# EAGLE design infinity_mirror_revd (EAGLE 9.6.2)
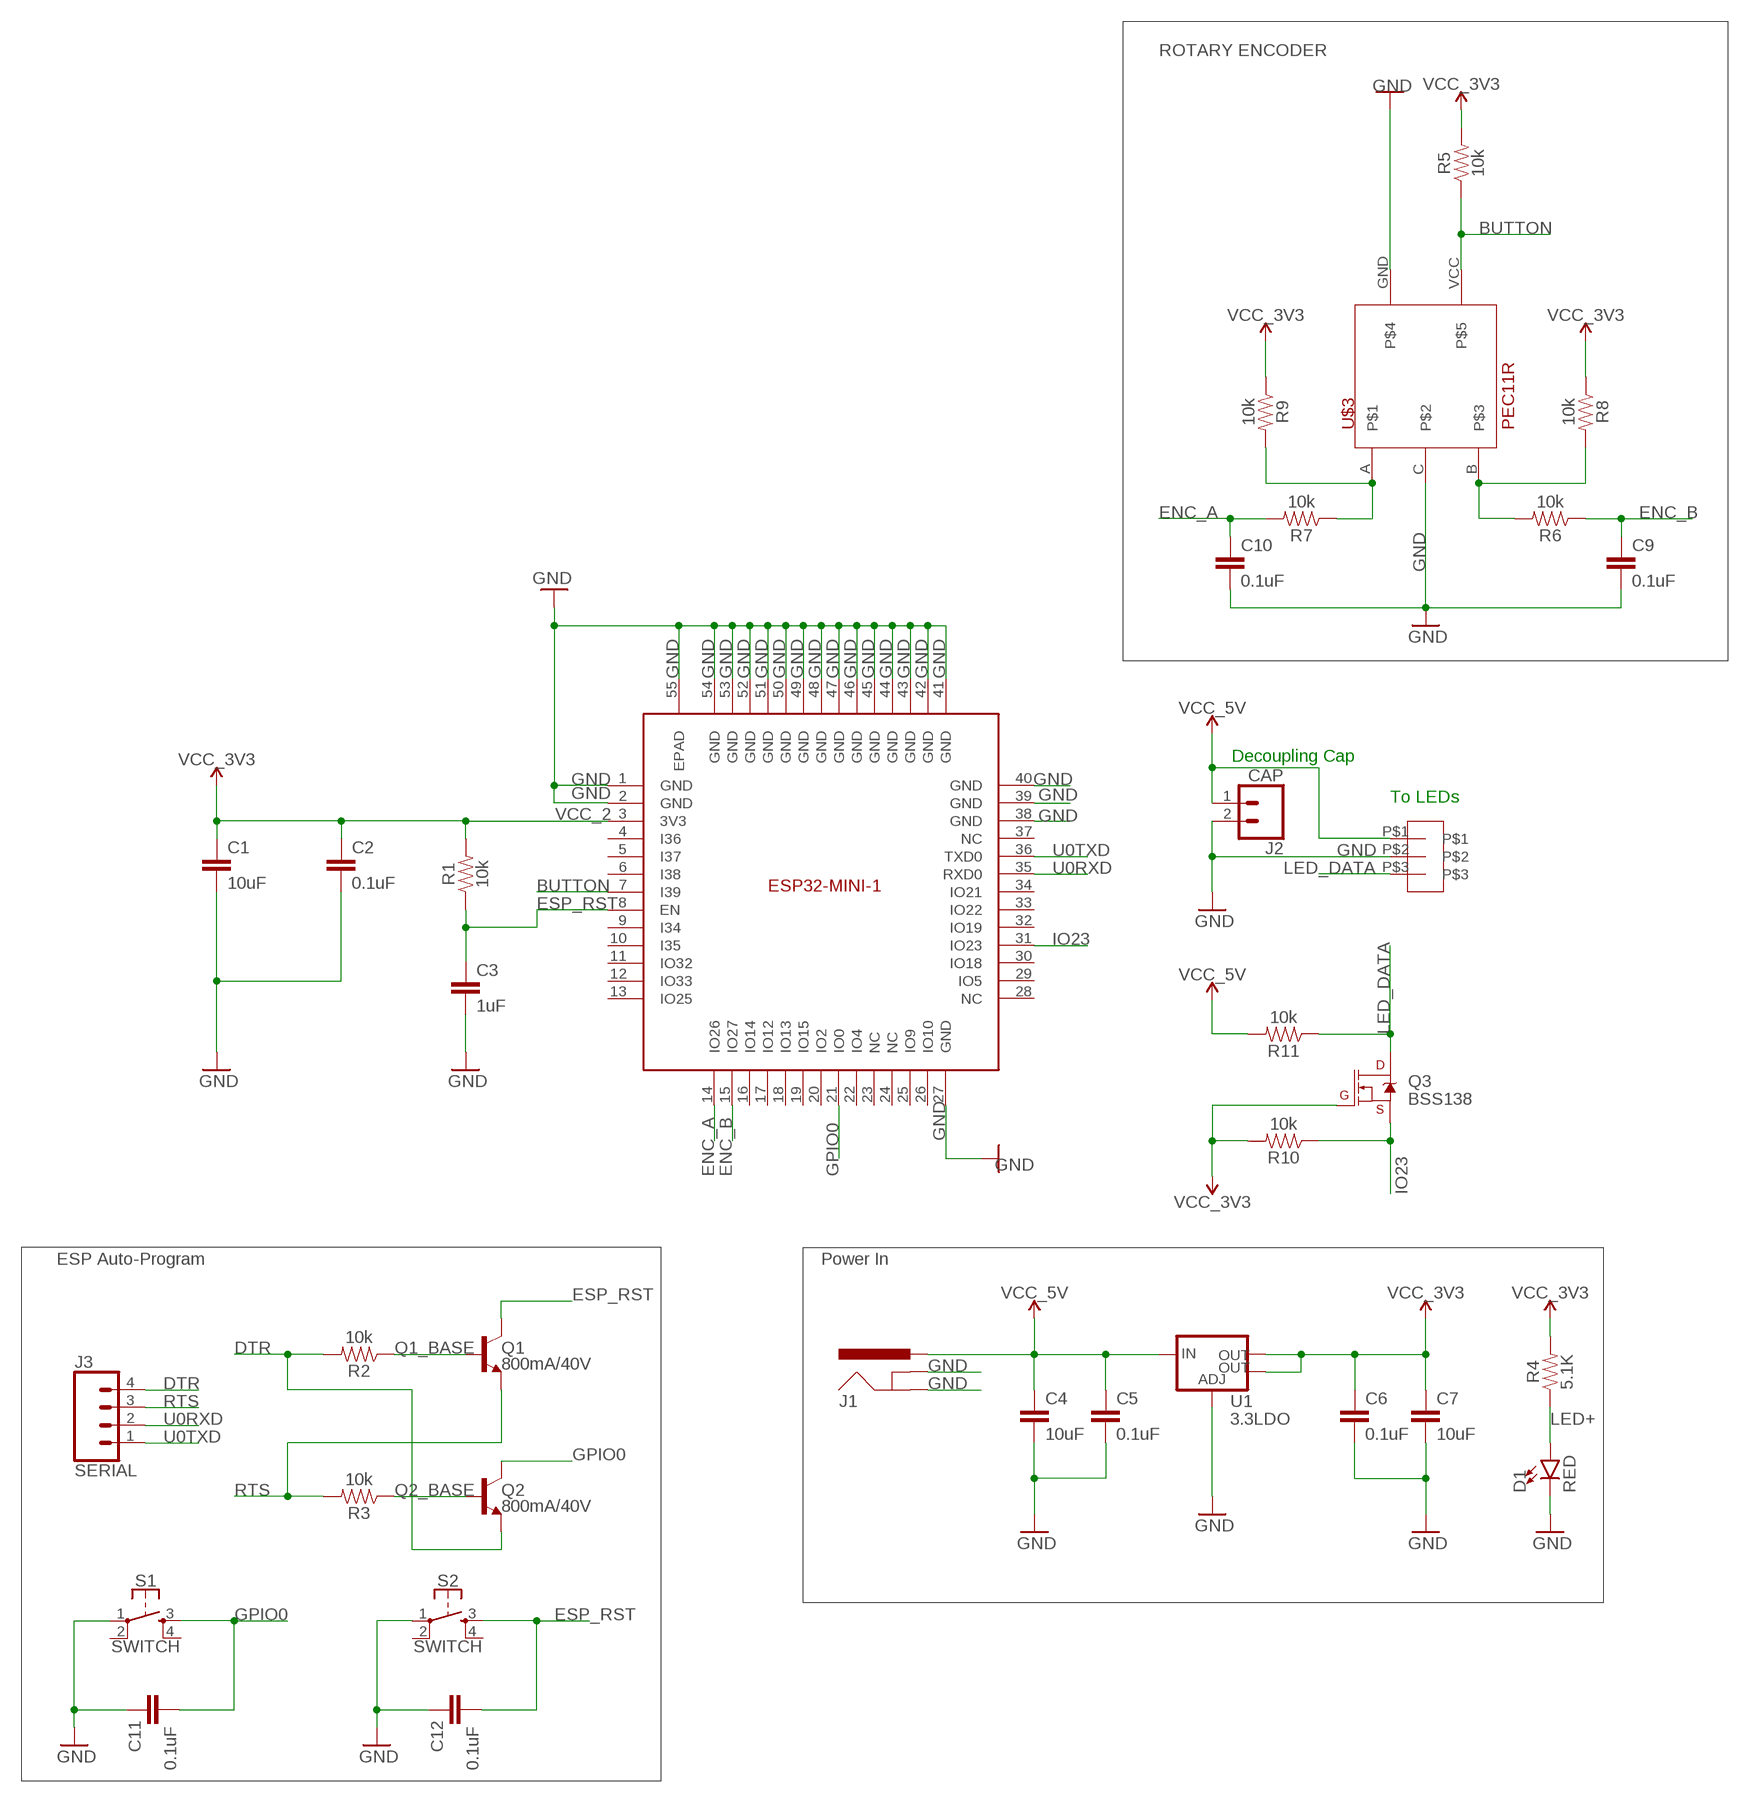
[diagram p0: schematic, sheet 1]

## Parts
C1  10uF  CAPACITOR  [0805]
C2  0.1uF  CAPACITOR  [0805]
C3  1uF  CAPACITOR  [0805]
C4  10uF  CAPACITOR  [0805]
C5  0.1uF  CAPACITOR  [0805]
C6  0.1uF  CAPACITOR  [0805]
C7  10uF  CAPACITOR  [0805]
C9  0.1uF  CAPACITOR  [0805]
C10  0.1uF  CAPACITOR  [0805]
C11  0.1uF  CAPACITOR  [0805]
C12  0.1uF  CAPACITOR  [0805]
D1  RED  LED-RED1206  [LED-1206]
J1  POWER_JACKPTH_BREAD  [POWER_JACK_PTH_BREAD]
J2  CAP  CONN_02  [1X02]
J3  SERIAL  CONN_04  [1X04]
Q1  800mA/40V  TRANS_NPN-MMBT2222AL  [SOT23-3]
Q2  800mA/40V  TRANS_NPN-MMBT2222AL  [SOT23-3]
Q3  BSS138  MOSFET-NCH-BSS138  [SOT23-3]
R1  10k  RESISTOR  [0805]
R2  10k  RESISTOR  [0805]
R3  10k  RESISTOR  [0805]
R4  5.1K  RESISTOR  [0805]
R5  10k  RESISTOR  [0805]
R6  10k  RESISTOR  [0805]
R7  10k  RESISTOR  [0805]
R8  10k  RESISTOR  [0805]
R9  10k  RESISTOR  [0805]
R10  10k  RESISTOR  [0805]
R11  10k  RESISTOR  [0805]
S1  SWITCH  MOMENTARY-SWITCH-SPST-2-SMD-5.2MM-TALL  [TACTILE_SWITCH_SMD_5.2MM]
S2  SWITCH  MOMENTARY-SWITCH-SPST-2-SMD-5.2MM-TALL  [TACTILE_SWITCH_SMD_5.2MM]
U1  3.3LDO  V_REG_LM1117SOT223  [SOT223]
U$1  ESP32-MINI-1-N4  [ESP32-MINI-1-N4]
U$2  3-PIN-JST  [3-PIN-JST]
U$3  PEC11R  PEC11R_ROTARY_ENCODER  [PEC11R-4320F-S0012]

## Nets
BUTTON: R5.1 U$1.7(I39) U$3.VCC
DTR: J3.4 Q2.2(E) R2.2
ENC_A: C10.1 R7.2 U$1.14(IO26)
ENC_B: C9.1 R6.1 U$1.15(IO27)
ESP_RST: C3.1 C12.2 Q1.3(C) R1.1 S2.3 U$1.8(EN)
GND: C1.2 C2.2 C3.2 C4.2 C5.2 C6.2 C7.2 C9.2 C10.2 C11.1 C12.1 D1.C J1.GND J1.GNDBREAK J2.2 S1.1 S2.1 U1.1(ADJ) U$1.1(GND) U$1.2(GND) U$1.27(GND) U$1.38(GND) U$1.39(GND) U$1.40(GND) U$1.41(GND) U$1.42(GND) U$1.43(GND) U$1.44(GND) U$1.45(GND) U$1.46(GND) U$1.47(GND) U$1.48(GND) U$1.49(GND) U$1.50(GND) U$1.51(GND) U$1.52(GND) U$1.53(GND) U$1.54(GND) U$1.55(EPAD) U$2.P$2 U$3.C U$3.GND
GPIO0: C11.2 Q2.3(C) S1.3 U$1.21(IO0)
IO23: Q3.2(S) R10.1 U$1.31(IO23)
LED+: D1.A R4.1
LED_DATA: Q3.3(D) R11.1 U$2.P$3
N$2: R6.2 R8.2 U$3.B
N$3: R7.1 R9.2 U$3.A
Q1_BASE: Q1.1(B) R2.1
Q2_BASE: Q2.1(B) R3.1
RTS: J3.3 Q1.2(E) R3.2
U0RXD: J3.2 U$1.35(RXD0)
U0TXD: J3.1 U$1.36(TXD0)
VCC_1: C4.1 C5.1 J1.PWR J2.1 R11.2 U1.3(IN) U$2.P$1 ; supply symbol labelled VCC_5V
VCC_2: C1.1 C2.1 C6.1 C7.1 Q3.1(G) R1.2 R4.2 R5.2 R8.1 R9.1 R10.2 U1.2(OUT) U1.4(OUT) U$1.3(3V3) ; supply symbol labelled VCC_3V3
Unconnected: S1.2 S1.4 S2.2 S2.4 U$1.4(I36) U$1.5(I37) U$1.6(I38) U$1.9(I34) U$1.10(I35) U$1.11(IO32) U$1.12(IO33) U$1.13(IO25) U$1.16(IO14) U$1.17(IO12) U$1.18(IO13) U$1.19(IO15) U$1.20(IO2) U$1.22(IO4) U$1.23(NC) U$1.24(NC) U$1.25(IO9) U$1.26(IO10) U$1.28(NC) U$1.29(IO5) U$1.30(IO18) U$1.32(IO19) U$1.33(IO22) U$1.34(IO21) U$1.37(NC)

## Notes on the sheet
- ROTARY ENCODER
- Decoupling Cap
- To LEDs
- ESP Auto-Program | Power In

## Library data of the parts
C1-C7 C9-C12 = _111_IH:CAPACITOR
D1 = SparkFun-LED:LED-RED: Red SMD LED Used in manufacturing of most products at SparkFun Packages: 0603 - SMD 0603 package [Product Link] <http://docs.avagotech.com/docs/AV02-0551EN> 0603 SMART - SMD 0603 SMART package ( more efficient and expensive)[Product Link] <http://www.osram-os.com/Graphics/XPic2/00077099_0.pdf> 1206 - SMD1206 package [Product Link] <https://www.sparkfun.com/datasheets/DevTools/LilyPad/Q150OVS4.pdff> SparkFun Products: Pro Mini 328 -5V <https://www.sparkfun.com/products/821> RedBoard <https://www.sparkfun.com/products/12757> IOIO-OTG <https://www.sparkfun.com/products/13613>; PROD_ID: DIO-09912
J1 = SparkFun-Connectors:POWER_JACK: Power Jack Connector This is the standard 5.5mm barrel jack for power. The PTH is the most common, proven, reliable, footprint. The Slot footprint only works if the mill layer is transmitted to the PCB fab house so be warned. Here are the connectors we sell at SparkFun: DC Barrel Power Jack/Connector <https://www.sparkfun.com/products/119> (PRT-00119) DC Barrel Power Jack/Connector (SMD) <https://www.sparkfun.com/products/12748> (PRT-12748) DC Barrel Jack Adapter - Breadboard Compatible <https://www.sparkfun.com/products/10811> (PRT-10811) It is used on this SparkFun product (and many, many others): SparkFun RedBoard - Programmed with Arduino <https://www.sparkfun.com/products/12757> (DEV-12757) Also, if you need a mating power supply or connector, please check these out: Wall Adapter Power Supply - 9VDC 650mA <https://www.sparkfun.com/products/298> (TOL-00298) DC Barrel Jack Adapter - Male <https://www.sparkfun.com/products/10287> (PRT-10287); PROD_ID: PRT-10811
J2 = SparkFun-Connectors:CONN_02: Multi connection point. Often used as Generic Header-pin footprint for 0.1 inch spaced/style header connections On any of the 0.1 inch spaced packages, you can populate with these: Break Away Headers - Straight <https://www.sparkfun.com/products/116> (PRT-00116) Break Away Male Headers - Right Angle <https://www.sparkfun.com/products/553> (PRT-00553) Female Headers <https://www.sparkfun.com/products/115> (PRT-00115) Break Away Headers - Machine Pin <https://www.sparkfun.com/products/117> (PRT-00117) Break Away Female Headers - Swiss Machine Pin <https://www.sparkfun.com/products/743> (PRT-00743) For SCREWTERMINALS and SPRING TERMINALS visit here: Screw Terimnals on SparkFun.com <https://www.sparkfun.com/search/results?term=Screw+Terminals> (5mm/3.5mm/2.54mm spacing) This device is also useful as a general connection point to wire up your design to another part of your project. Our various solder wires solder well into these plated through hole pads. Hook-Up Wire - Assortment (Stranded, 22 AWG) <https://www.sparkfun.com/products/11375> (PRT-11375) Hook-Up Wire - Assortment (Solid Core, 22 AWG) <https://www.sparkfun.com/products/11367> (PRT-11367) View the entire wire category on our website here <https://www.sparkfun.com/categories/141> Special notes: Molex polarized connector foot print use with: PRT-08233 with associated crimp pins and housings. 2.54_SCREWTERM for use with PRT-10571. 3.5mm Screw Terminal footprints for PRT-08084 5mm Screw Terminal footprints for use with PRT-08432
J3 = SparkFun-Connectors:CONN_04: Multi connection point. Often used as Generic Header-pin footprint for 0.1 inch spaced/style header connections On any of the 0.1 inch spaced packages, you can populate with these: Break Away Headers - Straight <https://www.sparkfun.com/products/116> (PRT-00116) Break Away Male Headers - Right Angle <https://www.sparkfun.com/products/553> (PRT-00553) Female Headers <https://www.sparkfun.com/products/115> (PRT-00115) Break Away Headers - Machine Pin <https://www.sparkfun.com/products/117> (PRT-00117) Break Away Female Headers - Swiss Machine Pin <https://www.sparkfun.com/products/743> (PRT-00743) For SCREWTERMINALS and SPRING TERMINALS visit here: Screw Terimnals on SparkFun.com <https://www.sparkfun.com/search/results?term=Screw+Terminals> (5mm/3.5mm/2.54mm spacing) This device is also useful as a general connection point to wire up your design to another part of your project. Our various solder wires solder well into these plated through hole pads. Hook-Up Wire - Assortment (Stranded, 22 AWG) <https://www.sparkfun.com/products/11375> (PRT-11375) Hook-Up Wire - Assortment (Solid Core, 22 AWG) <https://www.sparkfun.com/products/11367> (PRT-11367) View the entire wire category on our website here <https://www.sparkfun.com/categories/141> Special notes: Molex polarized connector foot print use with SKU : PRT-08231 with associated crimp pins and housings. 1MM SMD Version SKU: PRT-10208; PROD_ID: CONN-09696
Q1 Q2 = SparkFun-DiscreteSemi:TRANS_NPN: NPN transistor Current controlled devices typically used to amplify current or used as a switch. BC547 - COM-08928 <http://www.sparkfun.com/products/8928> (TO-92 45V 100mA) (1.Collector 2.Base 3.Emitter) 2N3904 - COM-00521 <http://www.sparkfun.com/products/521> (TO-92 40V 200mA) (1.Emitter 2.Base 3.Collector) P2N2222A - COM-12852 <http://www.sparkfun.com/products/12852> (TO-92 40V 600mA) (1.Collector 2.Base 3.Emitter); PROD_ID: TRANS-08049; VALUE: 600mA/40V
Q3 = SparkFun-DiscreteSemi:MOSFET-NCH: N-channel MOSFETs Voltage controlled devices that allow control of high current outputs. SparkFun Products: SparkFun OpenScale <https://www.sparkfun.com/products/13261> SparkFun Digital Sandbox <https://www.sparkfun.com/products/12651> SparkFun Monster Moto Shield <https://www.sparkfun.com/products/10182> SparkFun MOSFET Power Controller <https://www.sparkfun.com/products/11214>; PROD_ID: TRANS-00830; VALUE: 220mA/50V/3.5Ω
R1-R11 = _111_IH:RESISTOR
S1 S2 = SparkFun-Switches:MOMENTARY-SWITCH-SPST-2: Momentary Switch (Pushbutton) - SPST - Two Circuits Normally-open (NO) SPST momentary switches (buttons, pushbuttons). Schematic symbol includes two switch circuits. Variants SMD-4.6MMX2.8MM - 4.60mm x 2.80mm Tactile Momentary Button Switch - Used on SparkFun Pro Micro - RP2040 <https://www.sparkfun.com/products/17717> SMD-5.2MM - Mini Pushbutton Switch - SMD <https://www.sparkfun.com/products/8720> - Used on Arduino Pro Mini <https://www.sparkfun.com/products/11114>; PROD_ID: SWCH-14139
U1 = SparkFun-IC-Power:V_REG_LM1117: Voltage Regulator LM1117 Standard adjustable voltage regulator but in SMD form. Spark Fun Electronics SKU : COM-00595; PROD_ID: VREG-08170
U$1 = infinity_mirror_revd:ESP32-MINI-1-N4: ESP32-MINI-N4
U$2 = infinity_mirror_revd:3-PIN-JST
U$3 = infinity_mirror_revd:PEC11R_ROTARY_ENCODER: 4 = PC Pin Horizontal / Rear Facing 3 = 12 Detents 20 = 20.0mm long shaft F = Metal Flatted Shaft S = Push Momentary Switch 001 = 12 pulses per 360

## Board
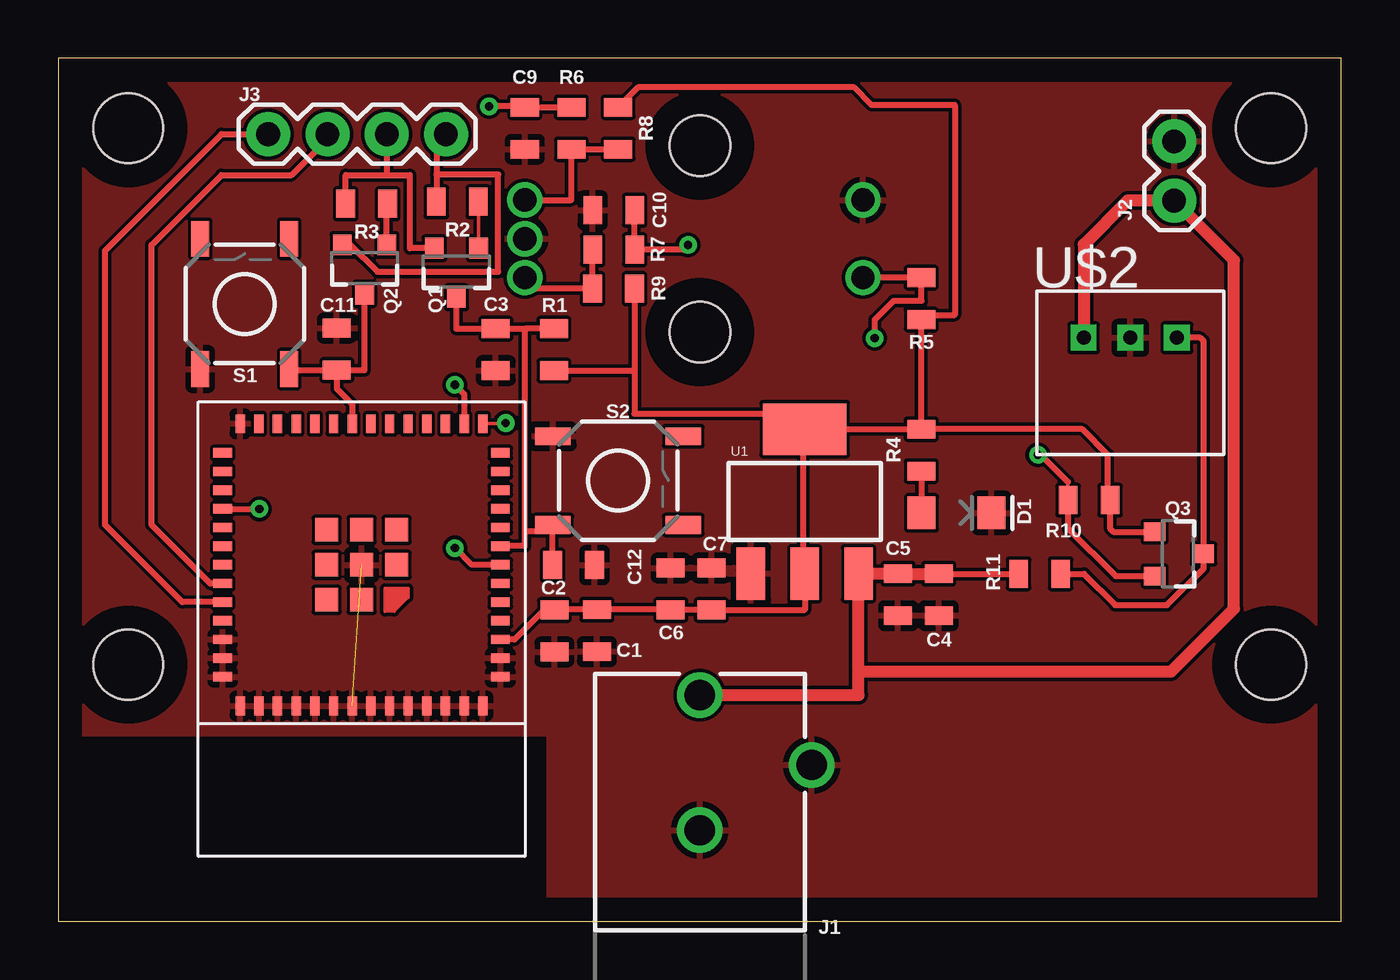
[diagram p1: board, top side]
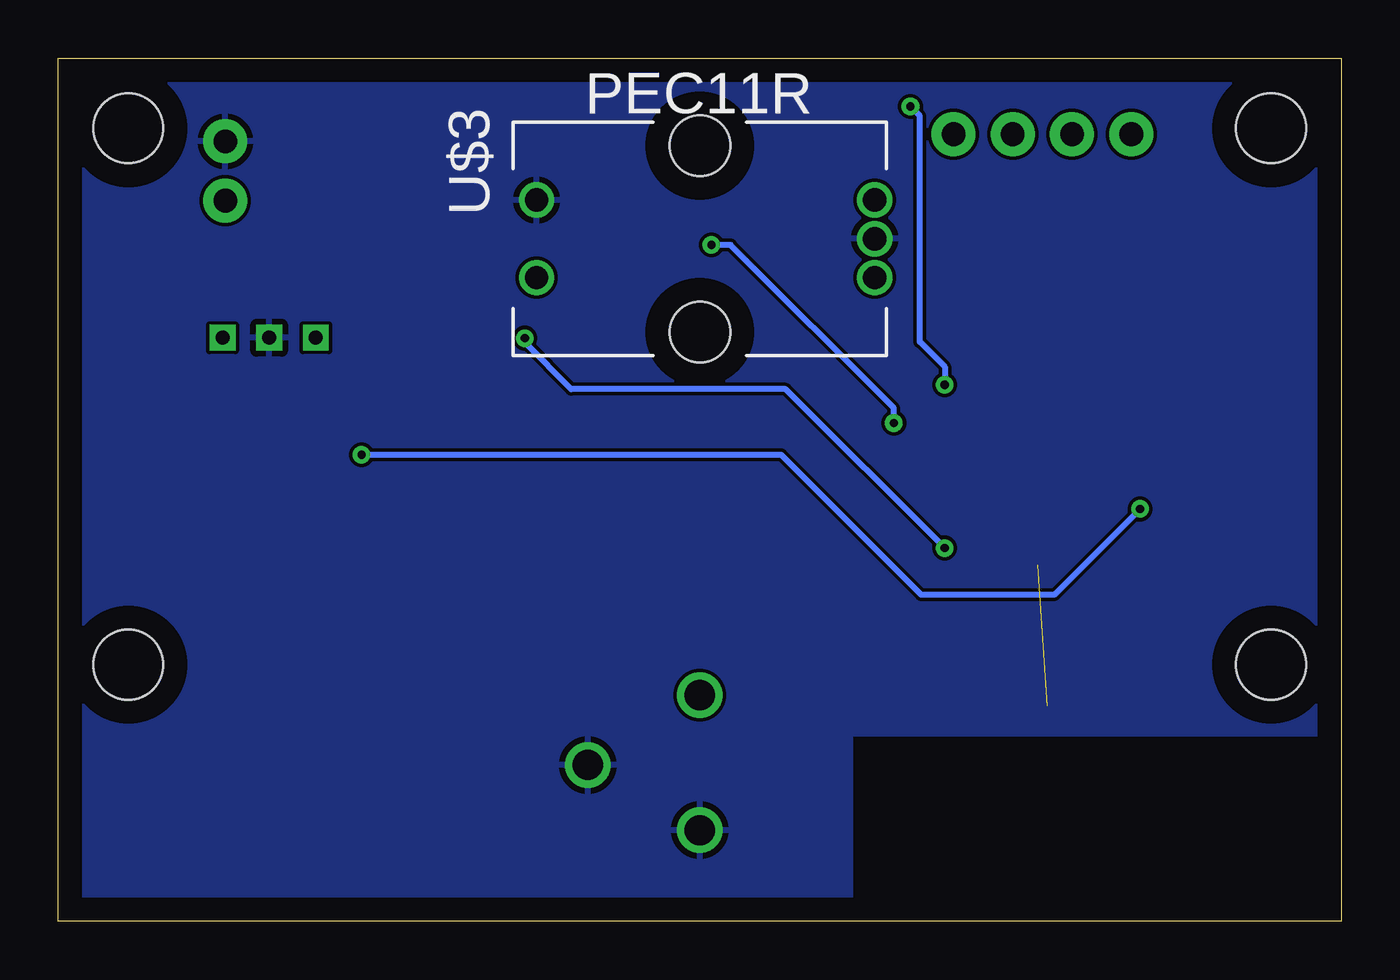
[diagram p2: board, bottom side, seen from below]

Size 55 x 37 mm. Coordinates in mm from the lower left corner, seen from the top.
Outline: 0,0 55,0 55,37 0,37 0,0
Copper layers (1*16): Top 0.035mm / dielectric 1.5mm / Bottom 0.035mm
Design rules "default": minimum track width 6mil, minimum drill 0.35mm, track to track 6mil, track to pad 6mil, pad to pad 6mil, via to via 6mil, smd to smd 6mil, copper to edge 40mil, drill to drill 6mil, minimum pad ring 10mil, minimum via ring 8mil, stop-mask expansion 4mil, vias tented up to drill 0mil, thermal gap 10mil
Holes 3 mm at 3,34 52,34 52,11 3,11
tKeepout: area 0.5,31.5 to 5.5,36.5; area 0.5,8.5 to 5.5,13.5; area 49.5,8.5 to 54.5,13.5; area 49.5,31.5 to 54.5,36.5

### Footprints (pad centres in the part's own frame; a part is rotated, then mirrored left to right if it is on the bottom)
0805 = smd 0.8 x 1.2: 1 -0.9,0; 2 0.9,0
LED-1206 = smd 1.2 x 1.4: A -1.5,0; C 1.5,0
POWER_JACK_PTH_BREAD = drill 1.3: GND 0,7.9; GNDBREAK 4.8,10.7; PWR 0,13.7
1X02 = drill 1.016 pad 1.88: 1 0,0; 2 2.54,0
1X04 = drill 1.016 pad 1.88: 1 0,0; 2 2.54,0; 3 5.08,0; 4 7.62,0
SOT23-3 = smd 0.8 x 0.9: 1 -0.95,-1; 2 0.95,-1; 3 0,1.1
TACTILE_SWITCH_SMD_5.2MM = smd 1.524 x 0.762: 1 -2.794,1.905; 2 2.794,1.905; 3 -2.794,-1.905; 4 2.794,-1.905
SOT223 = smd 1.219 x 2.235: 1 -2.311,-3.099; 2 0,-3.099; 3 2.311,-3.099 | smd 3.6 x 2.2: 4 0,3.099
ESP32-MINI-1-N4 = smd 0.8 x 0.4: 1 -5.95,4.8; 2 -5.95,4; 3 -5.95,3.2; 4 -5.95,2.4; 5 -5.95,1.6; 6 -5.95,0.8; 7 -5.95,0; 8 -5.95,-0.8; 9 -5.95,-1.6; 10 -5.95,-2.4; 11 -5.95,-3.2; 12 -5.95,-4; 13 -5.95,-4.8; 28 5.95,-4.8; 29 5.95,-4; 30 5.95,-3.2; 31 5.95,-2.4; 32 5.95,-1.6; 33 5.95,-0.8; 34 5.95,0; 35 5.95,0.8; 36 5.95,1.6; 37 5.95,2.4; 38 5.95,3.2; 39 5.95,4; 40 5.95,4.8 | smd 0.4 x 0.8: 14 -5.2,-6.05; 15 -4.4,-6.05; 16 -3.6,-6.05; 17 -2.8,-6.05; 18 -2,-6.05; 19 -1.2,-6.05; 20 -0.4,-6.05; 21 0.4,-6.05; 22 1.2,-6.05; 23 2,-6.05; 24 2.8,-6.05; 25 3.6,-6.05; 26 4.4,-6.05; 27 5.2,-6.05; 41 5.2,6.05; 42 4.4,6.05; 43 3.6,6.05; 44 2.8,6.05; 45 2,6.05; 46 1.2,6.05; 47 0.4,6.05; 48 -0.4,6.05; 49 -1.2,6.05; 50 -2,6.05; 51 -2.8,6.05; 52 -3.6,6.05; 53 -4.4,6.05; 54 -5.2,6.05 | smd 1 x 1: 55 0,0; P$56 -1.5,0; P$57 1.5,0; P$58 1.5,-1.5; P$59 0,-1.5; P$60 -1.5,-1.5; P$61 1.5,1.5; P$62 0,1.5
3-PIN-JST = drill 0.6 square: P$1 -2,0; P$2 0,0; P$3 2,0
PEC11R-4320F-S0012 = drill 1: A -1.667,-7.5; B 1.667,-7.5; C 0,-7.5; GND 1.667,7; VCC -1.667,7 | hole 2.6: -4,0; 4,0

### Placement (x,y rotation side)
C1  23.09,12.46 270 top
C2  21.27,12.45 270 top
C3  18.75,24.51 270 top
C4  37.75,14 270 top
C5  36,14 270 top
C6  26.25,14.25 90 top
C7  28,14.25 90 top
C9  20,34 270 top
C10  23.81,30.48 180 top
C11  11.94,24.53 270 top
C12  22.09,15.27 180 top
D1  38.51,17.51 0 top
J1  27.5,-4 0 top
J2  47.84,30.9 90 top
J3  9,33.75 0 top
Q1  17.07,27.85 180 top
Q2  13.13,28 180 top
Q3  48,15.75 270 top
R1  21.25,24.51 270 top
R2  17.11,30.85 180 top
R3  13.22,30.76 180 top
R4  37,20.2 90 top
R5  37,26.7 270 top
R6  22,34 270 top
R7  23.81,28.79 0 top
R8  24,34 270 top
R9  23.8,27.12 180 top
R10  44.19,18.06 0 top
R11  42.07,14.9 180 top
S1  7.99,26.47 90 top
S2  24,18.89 0 top
U1  32,18 0 top
U$1  13,15.28 180 top
U$2  45.96,25.02 0 top
U$3  27.5,29.26 90 bottom

### Tracks (layer width: path | path; a pad name or v marks a point on that pad's centre or on a via)
BUTTON  (via drill 0.35)
  Top 0.254: U$1.7 17.72,15.28 v17,16 | v35,25 35,25.79 35.82,26.61 37.01,26.61 R5.1 U$3.VCC
  Bottom 0.254: v17,16 23.82,22.82 33.01,22.82 35,24.8 v35,25
DTR
  Top 0.152: Q2.2 12.53,29
  Top 0.254: 12.53,29 13.68,27.85 18.86,27.85 18.86,32.02 16.21,32.02 R2.2 16.21,33.34 J3.4
ENC_A  (via drill 0.35)
  Top 0.152: U$1.14 19.15,21.33 v19.18,21.36
  Top 0.254: C10.1 R7.2 26.79,28.79 v27,29
  Bottom 0.254: v19.18,21.36 19.18,22 26.18,29 v27,29
ENC_B  (via drill 0.35)
  Top 0.254: R6.1 C9.1 19.95,34.95 18.48,34.95 v18.47,34.94 | v17,23 17.4,22.6 U$1.15
  Bottom 0.254: v17,23 17,23.78 18.07,24.85 18.07,34.54 v18.47,34.94
ESP_RST
  Top 0.152: 21.19,16.97 S2.3 20.94,16.72
  Top 0.254: C12.2 21.19,16.97 | 20.94,16.72 20,16.72 | U$1.8 20,16.08 20,16.72 | 20,16.72 20,25.41 | Q1.3 17.07,25.41 C3.1 20,25.41 | R1.1 20,25.41
GND  (1 unrouted)
  pour Top: 0,37 55,37 55,0 21,0 21,8 0,8
  pour Bottom: 0,37 0,8 21,8 21,0 55,0 55,37
GPIO0
  Top 0.152: S1.3 9.94,23.63
  Top 0.254: 9.94,23.63 C11.2 | C11.2 13.13,23.63 Q2.3 | C11.2 11.94,22.83 12.6,22.17 U$1.21
IO23  (via drill 0.35)
  Top 0.152: v42,20 42.13,20 | 43.29,18.84 R10.1
  Top 0.254: U$1.31 v8.62,17.68 | R10.1 43.29,16.84 45.33,14.8 Q3.2 | 43.29,18.84 42.13,20
  Bottom 0.254: v8.62,17.68 12.3,14 18,14 24,20 v42,20
LED+
  Top 0.152: R4.1
  Top 0.254: R4.1 D1.A
LED_DATA
  Top 0.254: U$2.P$3 48.96,25.02 49.1,24.88 Q3.3 49.1,15.12 47.53,13.56 45.31,13.56 43.97,14.9 R11.1
N$2
  Top 0.254: R8.2 R6.2 22,30.93 U$3.B
N$3
  Top 0.254: R7.1 R9.2 20.47,27.12 U$3.A
Q1_BASE
  Top 0.152: Q1.1 R2.1
Q2_BASE
  Top 0.254: Q2.1 14.08,30.72 R3.1
RTS
  Top 0.254: Q1.2 15.07,28.85 15.07,31.99 14,31.99 | R3.2 12.32,31.99 14,31.99 | J3.3 14.08,32.07 14,31.99
U0RXD
  Top 0.152: 11.54,33.54 J3.2
  Top 0.254: U$1.35 6.52,14.48 4,17 4,29 7,32 10,32 11.54,33.54
U0TXD
  Top 0.254: U$1.36 5.32,13.68 2,17 2,28.75 7,33.75 J3.1
VCC_1
  Top 0.254: C4.1 R11.2
  Top 0.508: C4.1 C5.1 U1.3 34.31,10.74 34.35,10.7 | U$2.P$1 43.96,29.02 45.84,30.9 J2.1 50.4,28.34 50.4,13.4 47.7,10.7 34.35,10.7 | J1.PWR 34.31,9.7 34.31,10.7 34.35,10.7
VCC_2
  Top 0.152: R4.2 | R5.2 37.2,26
  Top 0.254: U$1.3 19.55,12.08 20.82,13.35 C2.1 C1.1 C6.1 C7.1 32,13.35 U1.2 31.95,14.95 31.95,21.05 U1.4 | U1.4 R4.2 | R1.2 24.7,23.61 | R5.2 R4.2 43.9,21.1 45,20 45,18.15 R10.2 45.09,16.84 45.23,16.7 Q3.1 | 37.2,26 38.43,26 38.43,35 34.86,35 34.11,35.75 24.85,35.75 R8.1 | U1.4 31.35,21.75 24.7,21.75 24.7,23.61 | R9.1 24.7,23.61